# EAGLE schematic soilMonitor_NoHumid (EAGLE 8.1.0)
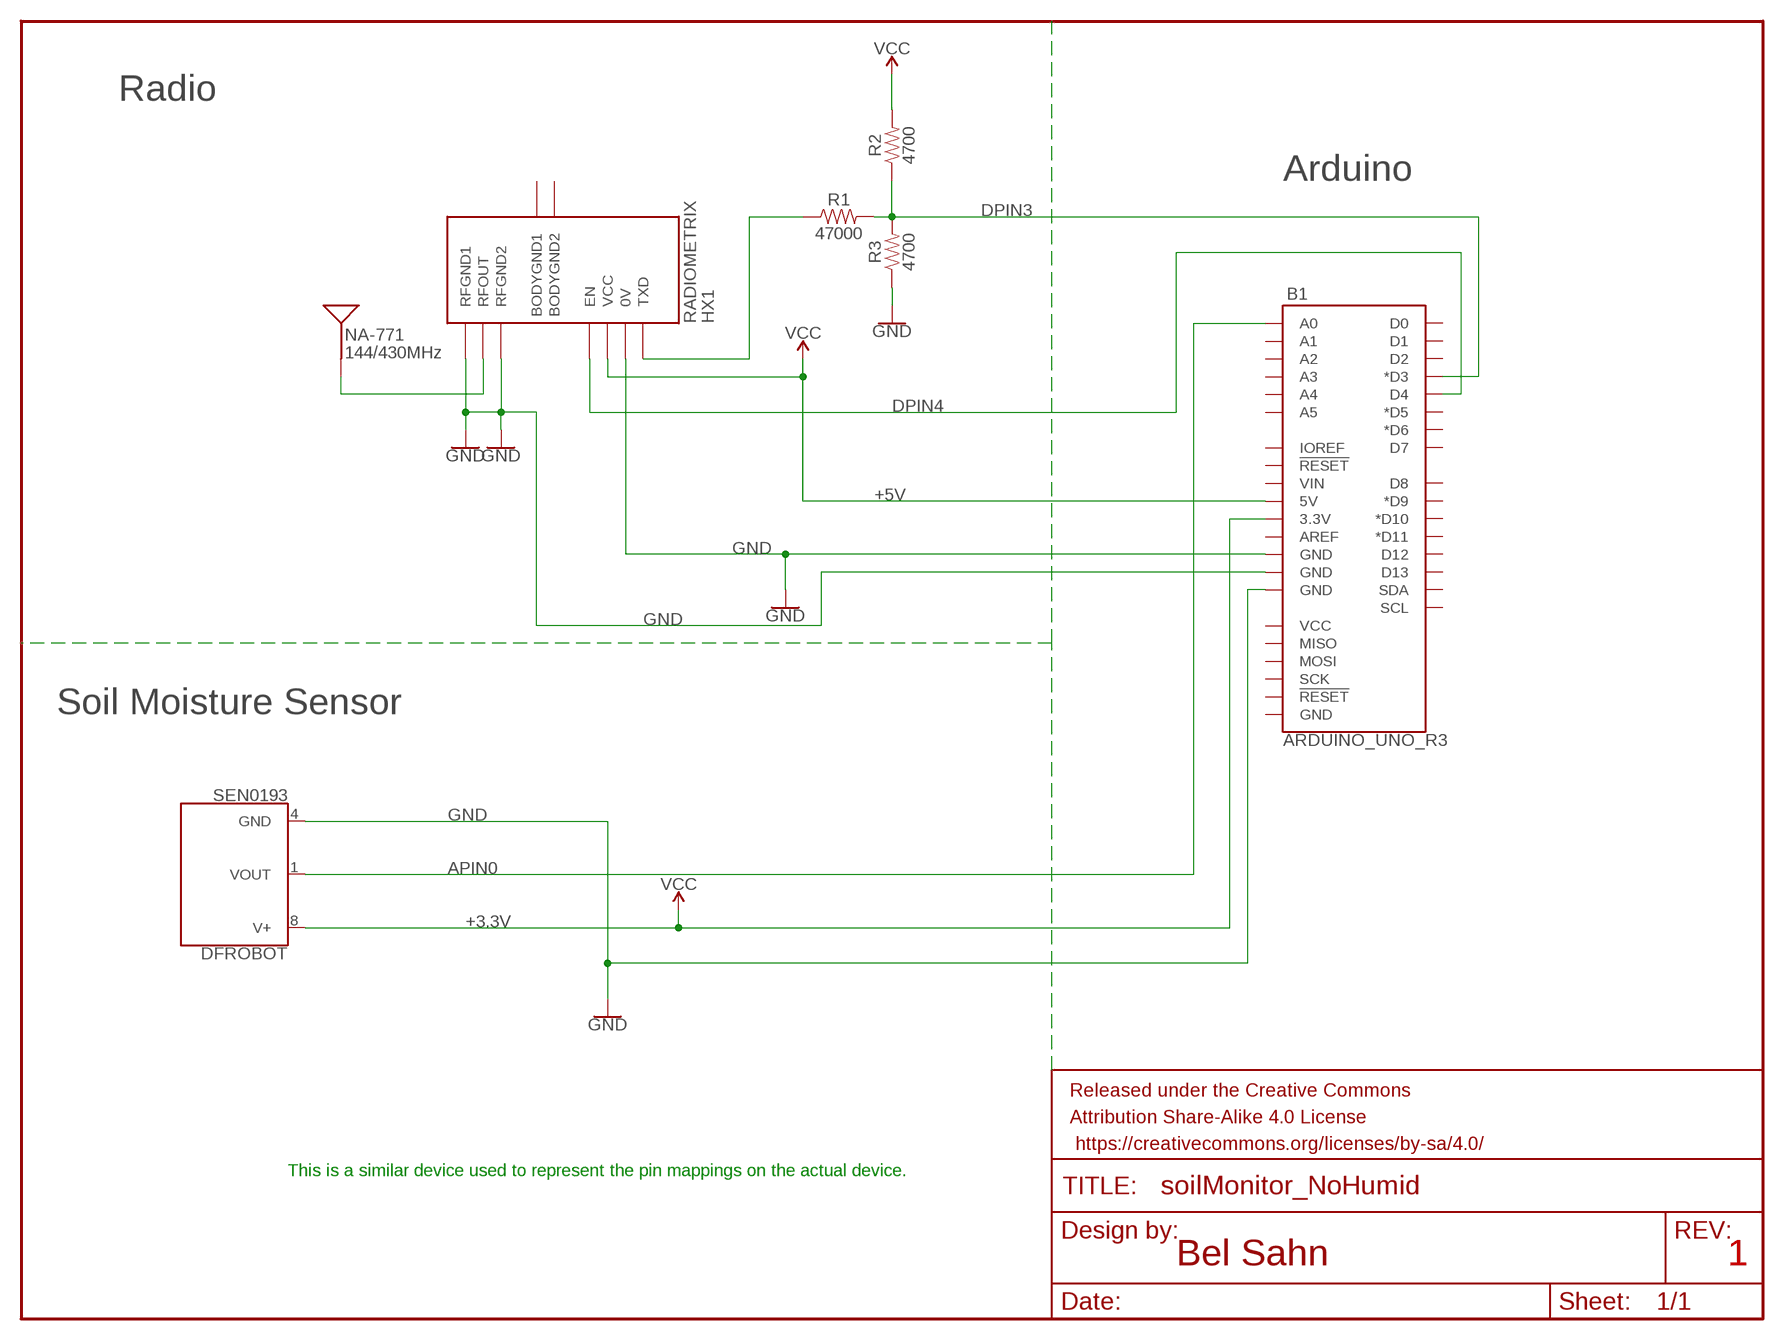
[diagram p0: schematic, sheet 1]

## Parts
B1  ARDUINO_UNO_R3  [ARDUINO_R3]
DFROBOT  SEN0193  LM34DM  [SOIC-8]
FRAME2  FRAME-LETTER  [CREATIVE_COMMONS]
NA-771  144/430MHz  ANTENNAGPS-2X8MM  [ANT-GPS-2X8MM]
R1  47000  0.1OHM-1210-1/2W-1%  [1210]
R2  4700  0.1OHM-1210-1/2W-1%  [1210]
R3  4700  0.1OHM-1210-1/2W-1%  [1210]
RADIOMETRIX  HX1  [HX1]

## Nets
+3.3V: B1.3.3V DFROBOT.8(V+) ; supply symbol labelled VCC
+5V: B1.5V RADIOMETRIX.VCC ; supply symbol labelled VCC
APIN0: B1.A0 DFROBOT.1(VOUT)
DPIN3: B1.D3(*D3) R1.2 R2.1 R3.2
DPIN4: B1.D4 RADIOMETRIX.EN
GND: B1.GND@2(GND) B1.GND@3(GND) B1.GND@4(GND) DFROBOT.4(GND) R3.1 RADIOMETRIX.0V RADIOMETRIX.RFGND1 RADIOMETRIX.RFGND2
N$3: R1.1 RADIOMETRIX.TXD
N$5: NA-771.SIG(SIGNAL) RADIOMETRIX.RFOUT
VCC: R2.2
Unconnected: B1.A1 B1.A2 B1.A3 B1.A4 B1.A5 B1.AREF B1.D0 B1.D1 B1.D2 B1.D5(*D5) B1.D6(*D6) B1.D7 B1.D8 B1.D9(*D9) B1.D10(*D10) B1.D11(*D11) B1.D12 B1.D13 B1.GND@1(GND) B1.IOREF B1.MISO B1.MOSI B1.RESET@1(!RESET!) B1.RESET@2(!RESET!) B1.SCK B1.SCL B1.SDA B1.VCC B1.VIN RADIOMETRIX.BODYGND1 RADIOMETRIX.BODYGND2

## Notes on the sheet
- Radio
- Arduino
- Soil Moisture Sensor
- This is a similar device used to represent the pin mappings on the actual device.
- Bel Sahn | 1

## Library data of the parts
B1 = SparkFun-Boards:ARDUINO_UNO_R3: Arduino R3 Footprint with SPI header Arduino Uno R3 Compatible Footprint. Matches PCB size of the original board. SparkFun Products: SAMD21 Dev Breakout <https://www.sparkfun.com/products/13672> RedBoard <https://www.sparkfun.com/products/12757> R3 Stackable Headers <https://www.sparkfun.com/products/11417>
DFROBOT = SparkFun-Sensors:LM34: Texas Instruments LM34 - Precision Fahrenheit Temperature Sensor 10mV/degF, 1 degF accurate analog temp sensor Datasheet <http://www.ti.com/lit/ds/symlink/lm34.pdf>; PROD_ID: IC-08232
FRAME2 = SparkFun-Aesthetics:FRAME-LETTER: Schematic Frame - Letter Standard 8.5x11 US Letter frame
NA-771 = SparkFun-GPS:ANTENNA: Single-ended Antennae 1.575GHz antennae with just one terminal. These are all chip antennae. 1575MHz (GPS) Antennae ANT-GPS-2X7MM - 2.0 x 7.0 mm chip antenna. (SparkFun Product <https://www.sparkfun.com/products/9131>) ANT-GPS-2X8MM - 2.0 x 8.0 mm chip antenna. (SparkFun Product <https://www.sparkfun.com/products/8418>); PROD_ID: GPS-08510; SF_ID: GPS-08418; VALUE: 1.575GHz
R1-R3 = SparkFun-Resistors:0.1OHM: 0.1Ω resistor A resistor is a passive two-terminal electrical component that implements electrical resistance as a circuit element. Resistors act to reduce current flow, and, at the same time, act to lower voltage levels within circuits. - Wikipedia; PROD_ID: RES-12374; VALUE: 0.1
RADIOMETRIX = trackuino:HX1

## Net classes
0 10: width 0.254 mm
1 15: width 0.381 mm
2 20: width 0.508 mm
3 30: width 0.762 mm
4 40: width 1.016 mm
5 50: width 1.27 mm
6 HIGH Current: width 2.54 mm